# Altium schematic sheet dboard_eagle_1.SchDoc
size 395 x 237 mm
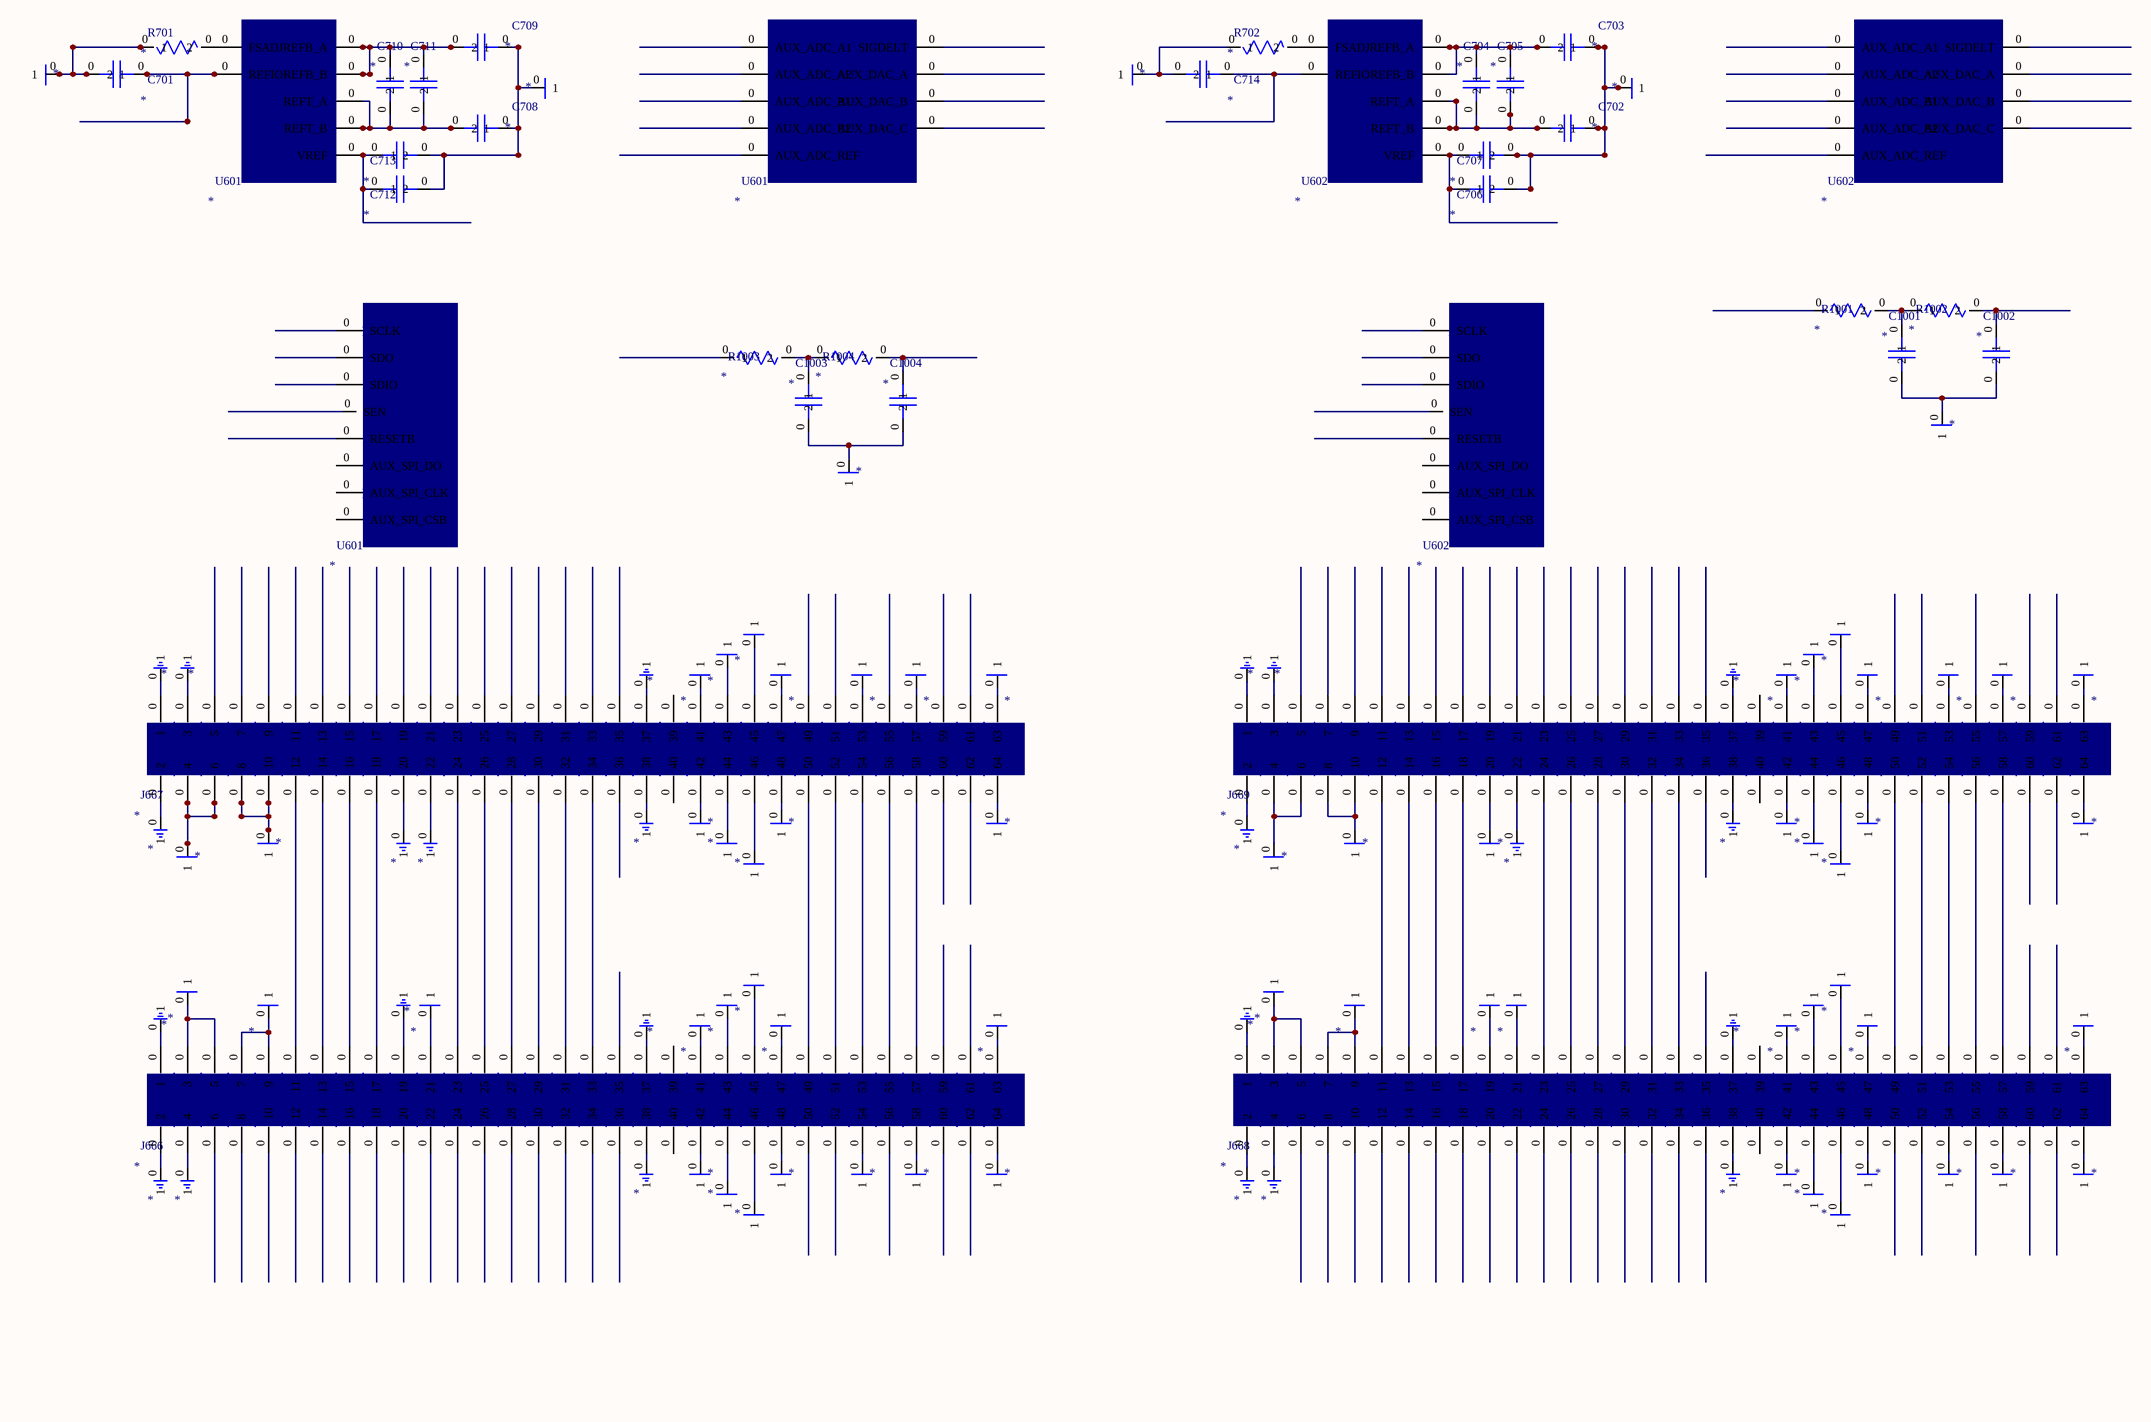
[diagram p0: dboard_eagle_1.SchDoc]

## Parts
C701  *
C702  *
C703  *
C704  *
C705  *
C706  *
C707  *
C708  *
C709  *
C710  *
C711  *
C712  *
C713  *
C714  *
C1001  *
C1002  *
C1003  *
C1004  *
GENERIC-POWER  *
GENERIC-POWER-2  *
GENERIC-POWER-3  *
GENERIC-POWER-4  *
GENERIC-POWER-9  *
GENERIC-POWER-10  *
GENERIC-POWER-15  *
GENERIC-POWER-16  *
GENERIC-POWER-17  *
GENERIC-POWER-18  *
GENERIC-POWER-19  *
GENERIC-POWER-20  *
GENERIC-POWER-21  *
GENERIC-POWER-26  *
GENERIC-POWER-27  *
GENERIC-POWER-28  *
GENERIC-POWER-29  *
GENERIC-POWER-32  *
GENERIC-POWER-35  *
GENERIC-POWER-36  *
GENERIC-POWER-37  *
GENERIC-POWER-38  *
GENERIC-POWER-42  *
GENERIC-POWER-43  *
GENERIC-POWER-44  *
GENERIC-POWER-48  *
GENERIC-POWER-53  *
GENERIC-POWER-54  *
GENERIC-POWER-59  *
GENERIC-POWER-60  *
GENERIC-POWER-61  *
GENERIC-POWER-62  *
GENERIC-POWER-63  *
GENERIC-POWER-64  *
GENERIC-POWER-65  *
GENERIC-POWER-70  *
GENERIC-POWER-71  *
GENERIC-POWER-72  *
GENERIC-POWER-73  *
GENERIC-POWER-76  *
GENERIC-POWER-79  *
GENERIC-POWER-80  *
GENERIC-POWER-81  *
GENERIC-POWER-82  *
GENERIC-POWER-83  *
GENERIC-POWER-84  *
GENERIC-POWER-85  *
GENERIC-POWER-86  *
GENERIC-POWER_MIRRORED  *
GENERIC-POWER_MIRRORED-22  *
GENERIC-POWER_MIRRORED-23  *
GENERIC-POWER_MIRRORED-24  *
GENERIC-POWER_MIRRORED-25  *
GENERIC-POWER_MIRRORED-30  *
GENERIC-POWER_MIRRORED-31  *
GENERIC-POWER_MIRRORED-33  *
GENERIC-POWER_MIRRORED-34  *
GENERIC-POWER_MIRRORED-41  *
GENERIC-POWER_MIRRORED-66  *
GENERIC-POWER_MIRRORED-67  *
GENERIC-POWER_MIRRORED-68  *
GENERIC-POWER_MIRRORED-69  *
GENERIC-POWER_MIRRORED-74  *
GENERIC-POWER_MIRRORED-75  *
GENERIC-POWER_MIRRORED-77  *
GENERIC-POWER_MIRRORED-78  *
GND-1  *
GND-1-5  *
GND-1-6  *
GND-1-7  *
GND-1-8  *
GND-1-11  *
GND-1-12  *
GND-1-13  *
GND-1-14  *
GND-1-45  *
GND-1-46  *
GND-1-47  *
GND-1-49  *
GND-1-50  *
GND-1-51  *
GND-1-52  *
GND-1-55  *
GND-1-56  *
GND-1-57  *
GND-1-58  *
GND-1-87  *
GND-1-88  *
GND-1-89  *
GND-1-90  *
J666  *
J667  *
J668  *
J669  *
R701  *
R702  *
R1001  *
R1002  *
R1003  *
R1004  *
U601  *
U601-39  *
U601-40  *
U602  *
U602-0  *
U602-1  *

## Nets
NetC701_0: C701.0(1) U601.0(REFIO)
NetC701_0: C701.0(2) GENERIC-POWER_MIRRORED-41.0(1) R701.0(1)  [a separate net that carries the same name]
NetC702_0: C702.0(1) C703.0(1) C706.0(2) C707.0(2) GENERIC-POWER.0(1)
NetC702_0: C702.0(2) C704.0(2) C705.0(2) U602.0(REFT_A)  [a separate net that carries the same name]
NetC703_0: C703.0(2) C704.0(1) C705.0(1) U602.0(REFB_A)
NetC706_0: C706.0(1) C707.0(1) U602.0(VREF)
NetC708_0: C708.0(1) C709.0(1) C712.0(2) C713.0(2) GENERIC-POWER-42.0(1)
NetC708_0: C708.0(2) C710.0(2) C711.0(2) U601.0(REFT_A)  [a separate net that carries the same name]
NetC709_0: C709.0(2) C710.0(1) C711.0(1) U601.0(REFB_A)
NetC712_0: C712.0(1) C713.0(1) U601.0(VREF)
NetC714_0: C714.0(1) U602.0(REFIO)
NetC714_0: C714.0(2) GENERIC-POWER_MIRRORED.0(1) R702.0(1)  [a separate net that carries the same name]
NetC1001_0: C1001.0(1) R1001.0(1) R1002.0(1)
NetC1001_0: C1001.0(2) C1002.0(2) GENERIC-POWER-85.0(1)  [a separate net that carries the same name]
NetC1002_0: C1002.0(1) R1002.0(2)
NetC1003_0: C1003.0(1) R1003.0(1) R1004.0(1)
NetC1003_0: C1003.0(2) C1004.0(2) GENERIC-POWER-86.0(1)  [a separate net that carries the same name]
NetC1004_0: C1004.0(1) R1004.0(2)
NetGENERIC-POWER-2_0: GENERIC-POWER-2.0(1) J668.0(64)
NetGENERIC-POWER-3_0: GENERIC-POWER-3.0(1) J669.0(8)
NetGENERIC-POWER-4_0: GENERIC-POWER-4.0(1) J668.0(21)
NetGENERIC-POWER-9_0: GENERIC-POWER-9.0(1) J669.0(64)
NetGENERIC-POWER-10_0: GENERIC-POWER-10.0(1) J668.0(63)
NetGENERIC-POWER-15_0: GENERIC-POWER-15.0(1) J668.0(42)
NetGENERIC-POWER-16_0: GENERIC-POWER-16.0(1) J669.0(42)
NetGENERIC-POWER-17_0: GENERIC-POWER-17.0(1) J669.0(41)
NetGENERIC-POWER-18_0: GENERIC-POWER-18.0(1) J668.0(41)
NetGENERIC-POWER-19_0: GENERIC-POWER-19.0(1) J668.0(58)
NetGENERIC-POWER-20_0: GENERIC-POWER-20.0(1) J668.0(54)
NetGENERIC-POWER-21_0: GENERIC-POWER-21.0(1) J668.0(48)
NetGENERIC-POWER-26_0: GENERIC-POWER-26.0(1) J669.0(48)
NetGENERIC-POWER-27_0: GENERIC-POWER-27.0(1) J668.0(47)
NetGENERIC-POWER-28_0: GENERIC-POWER-28.0(1) J668.0(45)
NetGENERIC-POWER-29_0: GENERIC-POWER-29.0(1) J668.0(43)
NetGENERIC-POWER-32_0: GENERIC-POWER-32.0(1) J668.0(3)
NetGENERIC-POWER-35_0: GENERIC-POWER-35.0(1) J669.0(43)
NetGENERIC-POWER-36_0: GENERIC-POWER-36.0(1) J669.0(45)
NetGENERIC-POWER-37_0: GENERIC-POWER-37.0(1) J669.0(4)
NetGENERIC-POWER-38_0: GENERIC-POWER-38.0(1) J668.0(7)
NetGENERIC-POWER-43_0: GENERIC-POWER-43.0(1) J666.0(64)
NetGENERIC-POWER-44_0: GENERIC-POWER-44.0(1) J667.0(8)
NetGENERIC-POWER-48_0: GENERIC-POWER-48.0(1) J666.0(21)
NetGENERIC-POWER-53_0: GENERIC-POWER-53.0(1) J667.0(64)
NetGENERIC-POWER-54_0: GENERIC-POWER-54.0(1) J666.0(63)
NetGENERIC-POWER-59_0: GENERIC-POWER-59.0(1) J666.0(42)
NetGENERIC-POWER-60_0: GENERIC-POWER-60.0(1) J667.0(42)
NetGENERIC-POWER-61_0: GENERIC-POWER-61.0(1) J667.0(41)
NetGENERIC-POWER-62_0: GENERIC-POWER-62.0(1) J666.0(41)
NetGENERIC-POWER-63_0: GENERIC-POWER-63.0(1) J666.0(58)
NetGENERIC-POWER-64_0: GENERIC-POWER-64.0(1) J666.0(54)
NetGENERIC-POWER-65_0: GENERIC-POWER-65.0(1) J666.0(48)
NetGENERIC-POWER-70_0: GENERIC-POWER-70.0(1) J667.0(48)
NetGENERIC-POWER-71_0: GENERIC-POWER-71.0(1) J666.0(47)
NetGENERIC-POWER-72_0: GENERIC-POWER-72.0(1) J666.0(45)
NetGENERIC-POWER-73_0: GENERIC-POWER-73.0(1) J666.0(43)
NetGENERIC-POWER-76_0: GENERIC-POWER-76.0(1) J666.0(3)
NetGENERIC-POWER-79_0: GENERIC-POWER-79.0(1) J667.0(43)
NetGENERIC-POWER-80_0: GENERIC-POWER-80.0(1) J667.0(45)
NetGENERIC-POWER-81_0: GENERIC-POWER-81.0(1) J667.0(4)
NetGENERIC-POWER-82_0: GENERIC-POWER-82.0(1) J666.0(7)
NetGENERIC-POWER-83_0: GENERIC-POWER-83.0(1) J668.0(19)
NetGENERIC-POWER-84_0: GENERIC-POWER-84.0(1) J669.0(20)
NetGENERIC-POWER_MIRRORED-22_0: GENERIC-POWER_MIRRORED-22.0(1) J669.0(63)
NetGENERIC-POWER_MIRRORED-23_0: GENERIC-POWER_MIRRORED-23.0(1) J669.0(57)
NetGENERIC-POWER_MIRRORED-24_0: GENERIC-POWER_MIRRORED-24.0(1) J669.0(53)
NetGENERIC-POWER_MIRRORED-25_0: GENERIC-POWER_MIRRORED-25.0(1) J669.0(47)
NetGENERIC-POWER_MIRRORED-30_0: GENERIC-POWER_MIRRORED-30.0(1) J669.0(46)
NetGENERIC-POWER_MIRRORED-31_0: GENERIC-POWER_MIRRORED-31.0(1) J669.0(44)
NetGENERIC-POWER_MIRRORED-33_0: GENERIC-POWER_MIRRORED-33.0(1) J668.0(46)
NetGENERIC-POWER_MIRRORED-34_0: GENERIC-POWER_MIRRORED-34.0(1) J668.0(44)
NetGENERIC-POWER_MIRRORED-66_0: GENERIC-POWER_MIRRORED-66.0(1) J667.0(63)
NetGENERIC-POWER_MIRRORED-67_0: GENERIC-POWER_MIRRORED-67.0(1) J667.0(57)
NetGENERIC-POWER_MIRRORED-68_0: GENERIC-POWER_MIRRORED-68.0(1) J667.0(53)
NetGENERIC-POWER_MIRRORED-69_0: GENERIC-POWER_MIRRORED-69.0(1) J667.0(47)
NetGENERIC-POWER_MIRRORED-74_0: GENERIC-POWER_MIRRORED-74.0(1) J667.0(46)
NetGENERIC-POWER_MIRRORED-75_0: GENERIC-POWER_MIRRORED-75.0(1) J667.0(44)
NetGENERIC-POWER_MIRRORED-77_0: GENERIC-POWER_MIRRORED-77.0(1) J666.0(46)
NetGENERIC-POWER_MIRRORED-78_0: GENERIC-POWER_MIRRORED-78.0(1) J666.0(44)
NetGND-1-5_0: GND-1-5.0(1) J668.0(1)
NetGND-1-6_0: GND-1-6.0(1) J669.0(1)
NetGND-1-7_0: GND-1-7.0(1) J669.0(2)
NetGND-1-8_0: GND-1-8.0(1) J668.0(2)
NetGND-1-11_0: GND-1-11.0(1) J668.0(38)
NetGND-1-12_0: GND-1-12.0(1) J669.0(37)
NetGND-1-13_0: GND-1-13.0(1) J669.0(38)
NetGND-1-14_0: GND-1-14.0(1) J668.0(37)
NetGND-1-45_0: GND-1-45.0(1) J667.0(20)
NetGND-1-46_0: GND-1-46.0(1) J667.0(22)
NetGND-1-47_0: GND-1-47.0(1) J666.0(19)
NetGND-1-49_0: GND-1-49.0(1) J666.0(1)
NetGND-1-50_0: GND-1-50.0(1) J667.0(1)
NetGND-1-51_0: GND-1-51.0(1) J667.0(2)
NetGND-1-52_0: GND-1-52.0(1) J666.0(2)
NetGND-1-55_0: GND-1-55.0(1) J666.0(38)
NetGND-1-56_0: GND-1-56.0(1) J667.0(37)
NetGND-1-57_0: GND-1-57.0(1) J667.0(38)
NetGND-1-58_0: GND-1-58.0(1) J666.0(37)
NetGND-1-87_0: GND-1-87.0(1) J667.0(3)
NetGND-1-88_0: GND-1-88.0(1) J666.0(4)
NetGND-1-89_0: GND-1-89.0(1) J669.0(3)
NetGND-1-90_0: GND-1-90.0(1) J668.0(4)
NetGND-1_0: GND-1.0(1) J669.0(22)
NetJ666_0: J666.0(11) J667.0(12)
NetJ666_0: J666.0(13) J667.0(14)  [a separate net that carries the same name]
NetJ666_0: J666.0(15) J667.0(16)  [a separate net that carries the same name]
NetJ666_0: J666.0(17) J667.0(18)  [a separate net that carries the same name]
NetJ666_0: J666.0(23) J667.0(24)  [a separate net that carries the same name]
NetJ666_0: J666.0(25) J667.0(26)  [a separate net that carries the same name]
NetJ666_0: J666.0(27) J667.0(28)  [a separate net that carries the same name]
NetJ666_0: J666.0(29) J667.0(30)  [a separate net that carries the same name]
NetJ666_0: J666.0(31) J667.0(32)  [a separate net that carries the same name]
NetJ666_0: J666.0(33) J667.0(34)  [a separate net that carries the same name]
NetJ666_0: J666.0(49) J667.0(50)  [a separate net that carries the same name]
NetJ666_0: J666.0(51) J667.0(52)  [a separate net that carries the same name]
NetJ666_0: J666.0(53) J667.0(54)  [a separate net that carries the same name]
NetJ666_0: J666.0(55) J667.0(56)  [a separate net that carries the same name]
NetJ666_0: J666.0(57) J667.0(58)  [a separate net that carries the same name]
NetJ668_0: J668.0(11) J669.0(12)
NetJ668_0: J668.0(13) J669.0(14)  [a separate net that carries the same name]
NetJ668_0: J668.0(15) J669.0(16)  [a separate net that carries the same name]
NetJ668_0: J668.0(17) J669.0(18)  [a separate net that carries the same name]
NetJ668_0: J668.0(23) J669.0(24)  [a separate net that carries the same name]
NetJ668_0: J668.0(25) J669.0(26)  [a separate net that carries the same name]
NetJ668_0: J668.0(27) J669.0(28)  [a separate net that carries the same name]
NetJ668_0: J668.0(29) J669.0(30)  [a separate net that carries the same name]
NetJ668_0: J668.0(31) J669.0(32)  [a separate net that carries the same name]
NetJ668_0: J668.0(33) J669.0(34)  [a separate net that carries the same name]
NetJ668_0: J668.0(49) J669.0(50)  [a separate net that carries the same name]
NetJ668_0: J668.0(51) J669.0(52)  [a separate net that carries the same name]
NetJ668_0: J668.0(53) J669.0(54)  [a separate net that carries the same name]
NetJ668_0: J668.0(55) J669.0(56)  [a separate net that carries the same name]
NetJ668_0: J668.0(57) J669.0(58)  [a separate net that carries the same name]
NetR701_0: R701.0(2) U601.0(FSADJ)
NetR702_0: R702.0(2) U602.0(FSADJ)

Not connected (* = marked no-connect by the designer): U601-39 0(AUX_ADC_A1); U601-40 0(AUX_SPI_CLK); U602-0 0(AUX_ADC_A1); U602-1 0(AUX_SPI_CLK)

## Notes on the sheet
- (in symbol AD986X-AUX) U601; U602
- (in symbol AD986X-CTRL) U601; U602

## Library data of the parts
C701 C714 = CAPACITOR-1_MIRRORED
C702-C713 C1001-C1004 = CAPACITOR-1
GENERIC-POWER GENERIC-POWER-2-GENERIC-POWER-4 GENERIC-POWER-9 GENERIC-POWER-10 GENERIC-POWER-15-GENERIC-POWER-21 GENERIC-POWER-26-GENERIC-POWER-29 GENERIC-POWER-32 GENERIC-POWER-35-GENERIC-POWER-38 GENERIC-POWER-42-GENERIC-POWER-44 GENERIC-POWER-48 GENERIC-POWER-53 GENERIC-POWER-54 GENERIC-POWER-59-GENERIC-POWER-65 GENERIC-POWER-70-GENERIC-POWER-73 GENERIC-POWER-76 GENERIC-POWER-79-GENERIC-POWER-86 = GENERIC-POWER
GENERIC-POWER_MIRRORED GENERIC-POWER_MIRRORED-22-GENERIC-POWER_MIRRORED-25 GENERIC-POWER_MIRRORED-30 GENERIC-POWER_MIRRORED-31 GENERIC-POWER_MIRRORED-33 GENERIC-POWER_MIRRORED-34 GENERIC-POWER_MIRRORED-41 GENERIC-POWER_MIRRORED-66-GENERIC-POWER_MIRRORED-69 GENERIC-POWER_MIRRORED-74 GENERIC-POWER_MIRRORED-75 GENERIC-POWER_MIRRORED-77 GENERIC-POWER_MIRRORED-78 = GENERIC-POWER_MIRRORED
GND-1 GND-1-5-GND-1-8 GND-1-11-GND-1-14 GND-1-45-GND-1-47 GND-1-49-GND-1-52 GND-1-55-GND-1-58 GND-1-87-GND-1-90 = GND-1
J666-J669 = PMC64_MIRRORED
R701 R702 = RESISTOR-1_MIRRORED
R1001-R1004 = RESISTOR-1
U601 U602 = AD986X-ACTRL
U601-39 U602-0 = AD986X-AUX
U601-40 U602-1 = AD986X-CTRL